# Altium project PM06-2305-IMU小板.PrjPcb
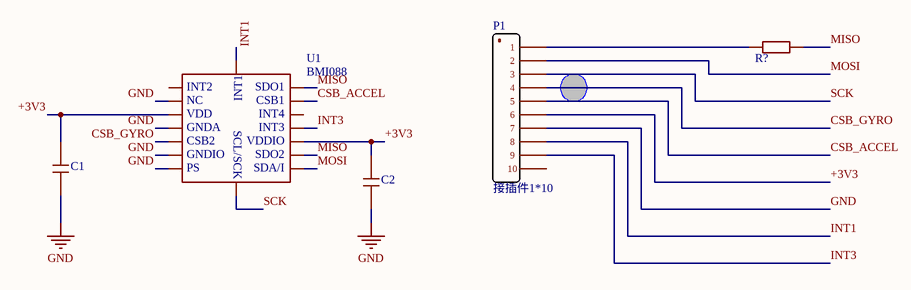
[diagram p0: main.SchDoc]
1 sheet, 5 parts. Net scope: global (net labels, ports and power ports of the same name join across sheets).
Board file: PM06-2305-IMU小板.PcbDoc

## Sheet main.SchDoc
size A4; SheetNumber: 1; SheetTotal: 1

### Parts
C1  100nF  [0603C]  (value not drawn)
C2  100nF  [0603C]  (value not drawn)
P1  接插件1*10  [FPC0.5-WT-10P]
R?  22  [0603R]  (value not drawn)
U1  BMI088  [LGA16]

### Nets
GND: C1.1 C2.1 P1.7 U1.2 U1.4 U1.6 U1.7
+3V3: C1.2 C2.2 P1.6 U1.3 U1.11
CSB_ACCEL: P1.5 U1.14
CSB_GYRO: P1.4 U1.5
INT1: P1.8 U1.16
INT3: P1.9 U1.12
MISO: R?.2 U1.10 U1.15
MOSI: P1.2 U1.9
SCK: P1.3 U1.8
NetP1_1: P1.1 R?.1

Not connected (* = marked no-connect by the designer): P1 10; U1 1 13(7)

### Notes on the sheet
- (in symbol 芯片/IC-陀螺仪-BMI088) INT1; INT2; SDO1; NC; CSB1; VDD; INT4; GNDA; INT3; CSB2; VDDIO; SCL/SCK; GNDIO; SDO2; PS; SDA/I

### Library data of the parts
C1 C2 = 电容_贴片
R? = 电阻_贴片
U1 = 芯片/IC-陀螺仪-BMI088